# Altium project final.PrjPcb
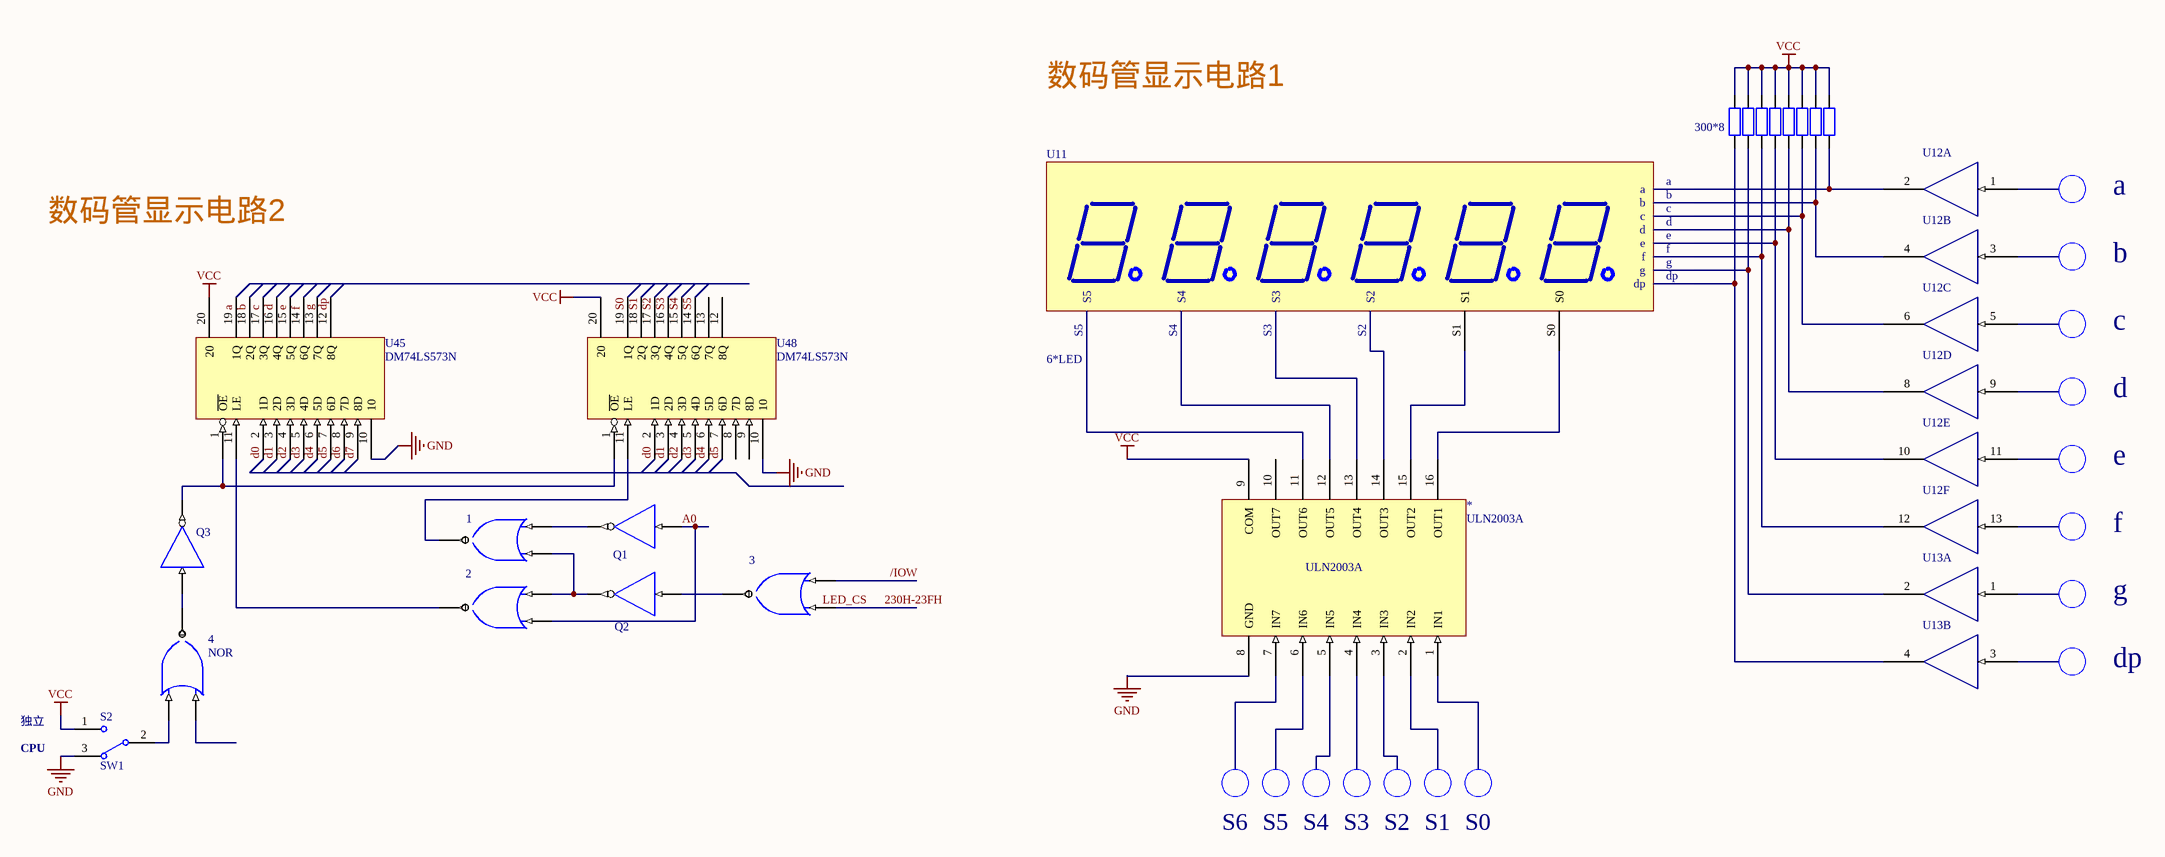
[diagram p0: 计算机原理课程设计.SchDoc]
2 sheets, 38 parts. Net scope: global (net labels, ports and power ports of the same name join across sheets).
Sheets:
  计算机原理课程设计.SchDoc
  计算机原理课程设计2.SchDoc

## Sheet 计算机原理课程设计.SchDoc: 计算机原理实验课程设计
size A0; Date: 2017/12/25; Organization: DLUT; DocumentNumber: 1; Revision: 1; SheetNumber: 1; SheetTotal: 1; CurrentTime: 10:26; DocumentFullPathAndName: E:\WorkSpace\计算机原理\计算机原理实验课程设计.ShcDoc; DocumentName: 计算机原理实验课程设计.ShcDoc

### Parts
1  (no value)
2  (no value)
3  (no value)
4  NOR
*  ULN2003A
Q1  NOT  (value not drawn)
Q2  NOT  (value not drawn)
Q3  NOT  (value not drawn)
R10  value 300*8  [AXIAL-0.4]  (hidden comment: Res2)
R11  Res2  [AXIAL-0.4]  (value not drawn)
R12  Res2  [AXIAL-0.4]  (value not drawn)
R13  Res2  [AXIAL-0.4]  (value not drawn)
R14  Res2  [AXIAL-0.4]  (value not drawn)
R15  Res2  [AXIAL-0.4]  (value not drawn)
R16  Res2  [AXIAL-0.4]  (value not drawn)
R17  Res2  [AXIAL-0.4]  (value not drawn)
S2  SW1  [TL36WW15050]
U11  6*LED
U12  SN74LS07D  (value not drawn)  (parts A,B,C,D,E,F of 6)
U13  SN74LS07D  (value not drawn)  (parts A,B of 6)
U45  DM74LS573N  [DIP-20]
U48  DM74LS573N  [DIP-20]

### Nets
GND: *.8(GND) S2.3 U45.10(GND) U48.10(GND)
VCC: *.9(COM) R10.2 R11.2 R12.2 R13.2 R14.2 R15.2 R16.2 R17.2 S2.1 U45.20(VCC) U48.20(VCC)
230H-23FH: 3.1(A)
/IOW: 3.2(B)
A0: 2.1(A) Q1.1(A)
d0: U45.2(1D) U48.2(1D)
d1: U45.3(2D) U48.3(2D)
d2: U45.4(3D) U48.4(3D)
d3: U45.5(4D) U48.5(4D)
d4: U45.6(5D) U48.6(5D)
d5: U45.7(6D) U48.7(6D)
d6: U45.8(7D)
d7: U45.9(8D)
Net1_1: 1.1(A) 2.2(B) Q2.2(Y)
Net1_2: 1.2(B) Q1.2(Y)
Net1_3: 1.3(Y) U48.11(LE)
Net2_3: 2.3(Y) U45.11(LE)
Net3_3: 3.3(Y) Q2.1(A)
Net4_1: 4.1(A) S2.2
Net4_3: 4.3(Y) Q3.1(A)
Net*_11: *.11(OUT6) U11.S5
Net*_12: *.12(OUT5) U11.S4
Net*_13: *.13(OUT4) U11.S3
Net*_14: *.14(OUT3) U11.S2
Net*_15: *.15(OUT2) U11.S1
Net*_16: *.16(OUT1) U11.S0
NetQ3_2: Q3.2(Y) U45.1(~{OE}) U48.1(~{OE})
NetR10_1: R10.1 U11.dp U13.4
NetR11_1: R11.1 U11.g U13.2
NetR12_1: R12.1 U11.f U12.12
NetR13_1: R13.1 U11.e U12.10
NetR14_1: R14.1 U11.d U12.8
NetR15_1: R15.1 U11.c U12.6
NetR16_1: R16.1 U11.b U12.4
NetR17_1: R17.1 U11.a U12.2

Not connected (* = marked no-connect by the designer): 4 2(B); * 1(IN1) 2(IN2) 3(IN3) 4(IN4) 5(IN5) 6(IN6) 7(IN7) 10(OUT7); U12 1 3 5 9 11 13; U13 1 3; U45 12(8Q) 13(7Q) 14(6Q) 15(5Q) 16(4Q) 17(3Q) 18(2Q) 19(1Q); U48 8(7D) 9(8D) 12(8Q) 13(7Q) 14(6Q) 15(5Q) 16(4Q) 17(3Q) 18(2Q) 19(1Q)

### Notes on the sheet
- 数码管显示电路1
- 数码管显示电路2
- a
- b
- c
- d
- e
- f
- g
- 独立
- dp
- CPU
- S6
- S5
- S4
- S3
- S2
- S1
- S0
- Labels drawn without touching a wire or pin: a, b, c, d, dp, e, f, g, LED_CS, S0, S1, S2, S3, S4, S5
- Title
- Size:
- Date:
- A4
- Number:
- Time:
- Revision:
- Sheet
- of
- File:

### Library data of the parts
1-3 = NOR
Q1-Q3 = NOT: Inverter
R10 = Res2: Resistor; Published: 8-Jun-2000; LatestRevisionDate: 17-Jul-2002; LatestRevisionNote: Re-released for DXP Platform.; PackageReference: AXIAL-0.4; Publisher: Altium Limited; PackageDescription: Axial Device, Thru-Hole; 2 Leads; 0.4 in Pin Spacing
R11-R17 = Res2: Resistor; Value: 300; Published: 8-Jun-2000; LatestRevisionDate: 17-Jul-2002; LatestRevisionNote: Re-released for DXP Platform.; PackageReference: AXIAL-0.4; Publisher: Altium Limited; PackageDescription: Axial Device, Thru-Hole; 2 Leads; 0.4 in Pin Spacing
S2 = SW-SPDT: SPDT Subminiature Toggle Switch, Right Angle Mounting, Vertical Actuation; Published: 24-Mar-1999; LatestRevisionDate: 17-Dec-2003; LatestRevisionNote: Schematic revised, PCB Footprint replaced.; DatasheetVersion: 05-Dec-2000; PackageReference: TL36WW15050; Publisher: Altium Limited; PackageDescription: Switch; 4 Leads; ComponentLink1Description: Manufacturer Link; ComponentLink1URL: http://www.apem.com
U45 = SN74HC573: OCTAL D-TYPE TRANSPARENT LCH 3SO
U48 = SN74HCT573: OCTAL D-TYPE TRANSPARENT LCH 3SO

## Sheet 计算机原理课程设计2.SchDoc
size A4
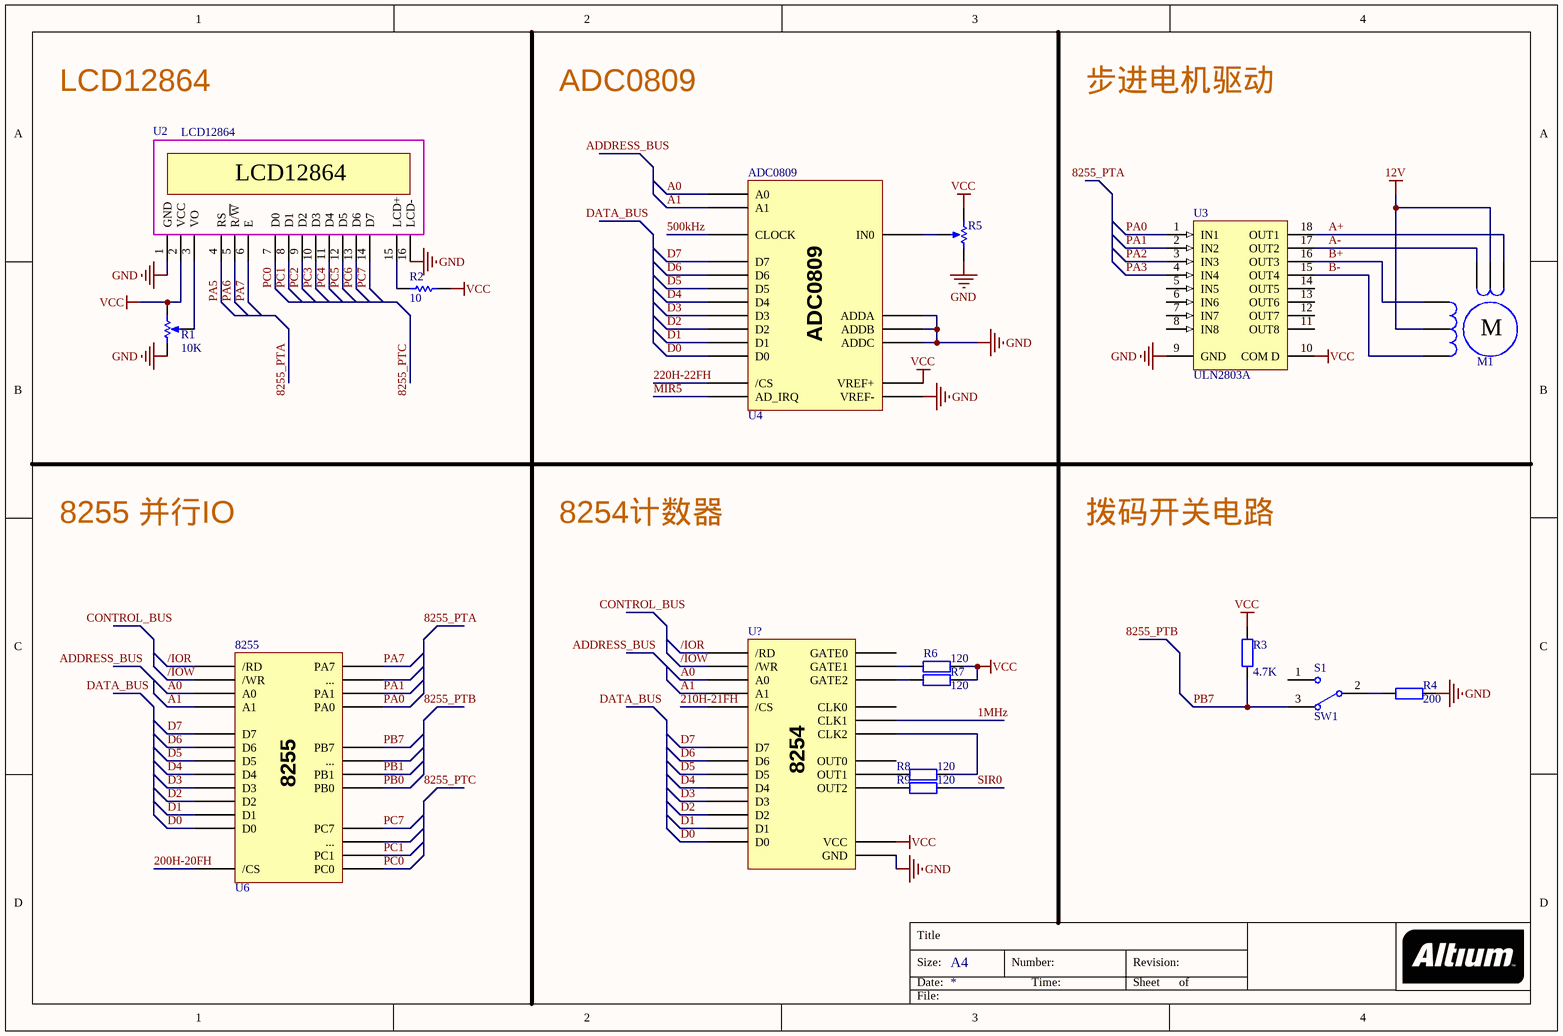
[diagram p1: 计算机原理课程设计2.SchDoc]

### Parts
8255  U6
ADC0809  U4
M1  MOTOR STEPPER  (value not drawn)
R1  value 10K  [VR5]  (hidden comment: RPot)
R2  value 10  [AXIAL-0.3]  (hidden comment: Res1)
R3  value 4.7K  [AXIAL-0.4]  (hidden comment: Res2)
R4  value 200  [AXIAL-0.4]  (hidden comment: Res2)
R5  RPot  [VR5]  (value not drawn)
R6  value 120  [AXIAL-0.4]  (hidden comment: Res2)
R7  value 120  [AXIAL-0.4]  (hidden comment: Res2)
R8  value 120  [AXIAL-0.4]  (hidden comment: Res2)
R9  value 120  [AXIAL-0.4]  (hidden comment: Res2)
S1  SW1  [TL36WW15050]
U2  LCD12864  [LCD1602]
U3  ULN2803A  [A18]
U?  8253A  (value not drawn)

### Nets
12V: M1.2 M1.5
GND: ADC0809.GND(ADDA) R1.1(TOP) R4.1 R5.2(BOT) U2.1(GND) U2.16(LCD-) U3.9(GND) U?.GND
VCC: ADC0809.GND(VREF+) R1.2(BOT) R2.1 R3.2 R5.1(TOP) R6.2 R7.2 U2.2(VCC) U3.10(COM_D) U?.GND(VCC)
1MHz: U?.GND(CLK1)
200H-20FH: 8255.GND(/CS)
210H-21FH: U?.GND(/CS)
220H-22FH: ADC0809.GND(/CS)
500kHz: ADC0809.GND(CLOCK)
/IOR: 8255.GND(/RD) U?.GND(/RD)
/IOW: 8255.GND(/WR) U?.GND(/WR)
A0: 8255.GND(A0) ADC0809.GND(A0) U?.GND(A0)
A1: 8255.GND(A1) ADC0809.GND(A1) U?.GND(A1)
A+: M1.1 U3.18(OUT1)
A-: M1.3 U3.17(OUT2)
B+: M1.4 U3.16(OUT3)
B-: M1.6 U3.15(OUT4)
d0: 8255.GND(D0) ADC0809.GND(D0) U?.GND(D0)
d1: 8255.GND(D1) ADC0809.GND(D1) U?.GND(D1)
d2: 8255.GND(D2) ADC0809.GND(D2) U?.GND(D2)
d3: 8255.GND(D3) ADC0809.GND(D3) U?.GND(D3)
d4: 8255.GND(D4) ADC0809.GND(D4) U?.GND(D4)
d5: 8255.GND(D5) ADC0809.GND(D5) U?.GND(D5)
d6: 8255.GND(D6) ADC0809.GND(D6) U?.GND(D6)
d7: 8255.GND(D7) ADC0809.GND(D7) U?.GND(D7)
MIR5: ADC0809.GND(AD_IRQ)
PA0: 8255.GND(PA0) U3.1(IN1)
PA1: 8255.GND(PA1) U3.2(IN2)
PA2: U3.3(IN3)
PA3: U3.4(IN4)
PA5: U2.4(RS)
PA6: U2.5(R/~{W})
PA7: 8255.GND(PA7) U2.6(E)
PB0: 8255.GND(PB0)
PB1: 8255.GND(PB1)
PB7: 8255.GND(PB7) R3.1 S1.3
PC0: 8255.GND(PC0) U2.7(D0)
PC1: 8255.GND(PC1) U2.8(D1)
PC2: U2.9(D2)
PC3: U2.10(D3)
PC4: U2.11(D4)
PC5: U2.12(D5)
PC6: U2.13(D6)
PC7: 8255.GND(PC7) U2.14(D7)
SIR0: R9.2
NetADC0809_GND: ADC0809.GND(IN0) R5.3(TAP)
NetR1_3: R1.3(TAP) U2.3(VO)
NetR2_2: R2.2 U2.15(LCD+)
NetR4_2: R4.2 S1.2
NetR6_1: R6.1 U?.GND(GATE1)
NetR7_1: R7.1 U?.GND(GATE2)
NetR8_1: R8.1 U?.GND(OUT1)
NetR8_2: R8.2 U?.GND(CLK2)
NetR9_1: R9.1 U?.GND(OUT2)

Not connected (* = marked no-connect by the designer): S1 1; U3 5(IN5) 6(IN6) 7(IN7) 8(IN8) 11(OUT8) 12(OUT7) 13(OUT6) 14(OUT5)

### Notes on the sheet
- LCD12864
- ADC0809
- 步进电机驱动
- (near U2) LCD12864
- (near M1) M
- 8255 并行IO
- 8254计数器
- 拨码开关电路
- Labels drawn without touching a wire or pin: 8255_PTA, 8255_PTB, 8255_PTC, ADDRESS_BUS, CONTROL_BUS, DATA_BUS
- Title
- Size:
- Date:
- A4
- Number:
- Time:
- Revision:
- Sheet
- of
- File:
- (in symbol 8253A) 8254

### Library data of the parts
8255 = 8255
ADC0809 = ADC0809
R1 = RPot: Potentiometer; Sim Note: Enter the Resistance value and the set point into parameter fields.; Set Position: 0.5; Published: 8-Jun-2000; LatestRevisionDate: 17-Jul-2002; LatestRevisionNote: Re-released for DXP Platform.; PackageReference: VR5; Publisher: Altium Limited; PackageDescription: Variable Resistor, Thru-Hole; 3 Leads
R2 = Res1: Resistor; Published: 8-Jun-2000; LatestRevisionDate: 17-Jul-2002; LatestRevisionNote: Re-released for DXP Platform.; PackageReference: AXIAL-0.3; Publisher: Altium Limited; PackageDescription: Axial Device, Thru-Hole; 2 Leads; 0.3 in Pin Spacing
R3 R4 R6-R9 = Res2: Resistor; Published: 8-Jun-2000; LatestRevisionDate: 17-Jul-2002; LatestRevisionNote: Re-released for DXP Platform.; PackageReference: AXIAL-0.4; Publisher: Altium Limited; PackageDescription: Axial Device, Thru-Hole; 2 Leads; 0.4 in Pin Spacing
R5 = RPot: Potentiometer; Sim Note: Enter the Resistance value and the set point into parameter fields.; Set Position: 0.5; Value: 10K; Published: 8-Jun-2000; LatestRevisionDate: 17-Jul-2002; LatestRevisionNote: Re-released for DXP Platform.; PackageReference: VR5; Publisher: Altium Limited; PackageDescription: Variable Resistor, Thru-Hole; 3 Leads
S1 = SW-SPDT: as S2 on sheet 计算机原理课程设计; Published: 24-Mar-1999; LatestRevisionDate: 17-Dec-2003; LatestRevisionNote: Schematic revised, PCB Footprint replaced.; DatasheetVersion: 05-Dec-2000; PackageReference: TL36WW15050; Publisher: Altium Limited; PackageDescription: Switch; 4 Leads; ComponentLink1Description: Manufacturer Link; ComponentLink1URL: http://www.apem.com
U2 = LCD1602
U3 = ULN2803A: High-Voltage, High-Current Darlington Array; Published: 13-Oct-2000; LatestRevisionDate: 06-Jun-2005; LatestRevisionNote: Stylized 3D Model Added.; DatasheetVersion: 1999; PackageVersion: 1999; PackageReference: A18; Publisher: Altium Limited; PackageDescription: DIP; 18 Leads; Row Spacing 7.62 mm; Pitch 2.54 mm; ComponentLink1Description: Manufacturer Link; ComponentLink1URL: http://www.allegromicro.com/

## Nets that join several sheets
GND: 计算机原理课程设计 (*.8 S2.3 U45.10 U48.10), 计算机原理课程设计2 (8 pins)
VCC: 计算机原理课程设计 (12 pins), 计算机原理课程设计2 (10 pins)
/IOW: 计算机原理课程设计 (3.2), 计算机原理课程设计2 (8255.GND U?.GND)
A0: 计算机原理课程设计 (2.1 Q1.1), 计算机原理课程设计2 (8255.GND ADC0809.GND U?.GND)
d0: 计算机原理课程设计 (U45.2 U48.2), 计算机原理课程设计2 (8255.GND ADC0809.GND U?.GND)
d1: 计算机原理课程设计 (U45.3 U48.3), 计算机原理课程设计2 (8255.GND ADC0809.GND U?.GND)
d2: 计算机原理课程设计 (U45.4 U48.4), 计算机原理课程设计2 (8255.GND ADC0809.GND U?.GND)
d3: 计算机原理课程设计 (U45.5 U48.5), 计算机原理课程设计2 (8255.GND ADC0809.GND U?.GND)
d4: 计算机原理课程设计 (U45.6 U48.6), 计算机原理课程设计2 (8255.GND ADC0809.GND U?.GND)
d5: 计算机原理课程设计 (U45.7 U48.7), 计算机原理课程设计2 (8255.GND ADC0809.GND U?.GND)
d6: 计算机原理课程设计 (U45.8), 计算机原理课程设计2 (8255.GND ADC0809.GND U?.GND)
d7: 计算机原理课程设计 (U45.9), 计算机原理课程设计2 (8255.GND ADC0809.GND U?.GND)